# EAGLE design Accessory - Power v2 (EAGLE 5.06)
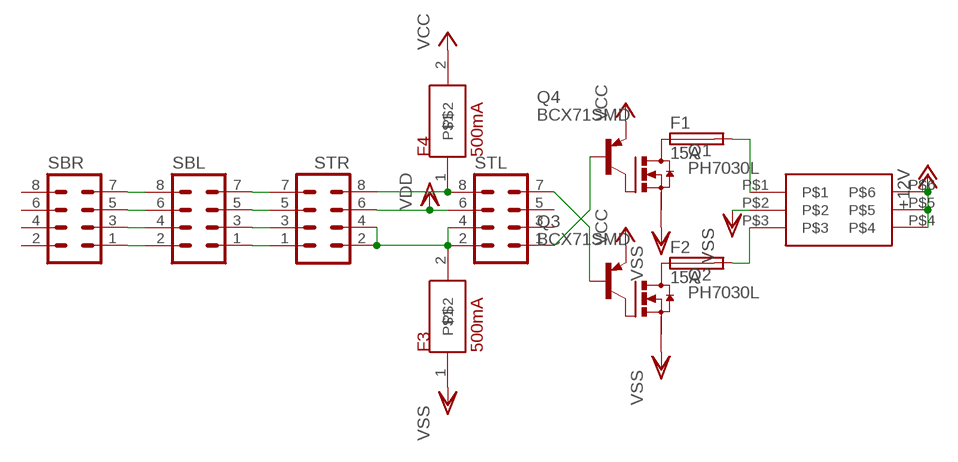
[diagram p0: schematic, sheet 1]

## Parts
F1  15A  FUSEPICOFUSE  [PICOFUSE]
F2  15A  FUSEPICOFUSE  [PICOFUSE]
F3  500mA  FUSE  [R0603]
F4  500mA  FUSE  [R0603]
Q1  PH7030L  [SOT669]
Q2  PH7030L  [SOT669]
Q3  BCX71SMD  [SOT23]
Q4  BCX71SMD  [SOT23]
SBL  MA04-2  [MA04-2]
SBR  MA04-2  [MA04-2]
STL  MA04-2  [MA04-2]
STR  MA04-2  [MA04-2]
U$1  015246040  [015246040]

## Nets
+12V: U$1.P$4 U$1.P$5 U$1.P$6
N$2: Q1.4(G) Q4.3(C)
N$3: Q2.4(G) Q3.3(C)
N$4: Q4.1(B) STL.1
N$5: Q3.1(B) STL.7
N$6: F2.1 Q2.MB(D)
N$7: F1.1 Q1.MB(D)
N$8: SBL.7 STR.7
N$9: SBL.5 STR.5
N$10: SBL.3 STR.3
N$11: SBL.1 STR.1
N$12: SBL.2 SBR.1
N$13: SBL.4 SBR.3
N$14: SBL.6 SBR.5
N$15: SBL.8 SBR.7
N$20: F4.1 STL.8 STR.8
N$21: F3.2 STL.2 STL.4 STR.2 STR.4
N$22: F2.2 U$1.P$3
N$23: F1.2 U$1.P$1
VCC: F4.2 Q3.2(E) Q4.2(E)
VDD: STL.6 STR.6
VSS: F3.1 Q1.1(S) Q2.1(S) U$1.P$2
Unconnected: Q1.2(S) Q1.3(S) Q2.2(S) Q2.3(S) SBR.2 SBR.4 SBR.6 SBR.8 STL.3 STL.5

## Library data of the parts
F1 F2 = fuse:FUSE: Fuse
F3 F4 = rcl:FUSE
Q1 Q2 = transistor-power:PH7030L: N-channel TrenchMOS (TM) logic level FET Source: http://www.nxp.com/acrobat_download/datasheets/PH7030L_4.pdf
Q3 Q4 = transistor-pnp:BCX71SMD: PNP Transistor
SBL SBR STL STR = con-lstb:MA04-2: PIN HEADER
U$1 = Power Headers:015246040

## Board
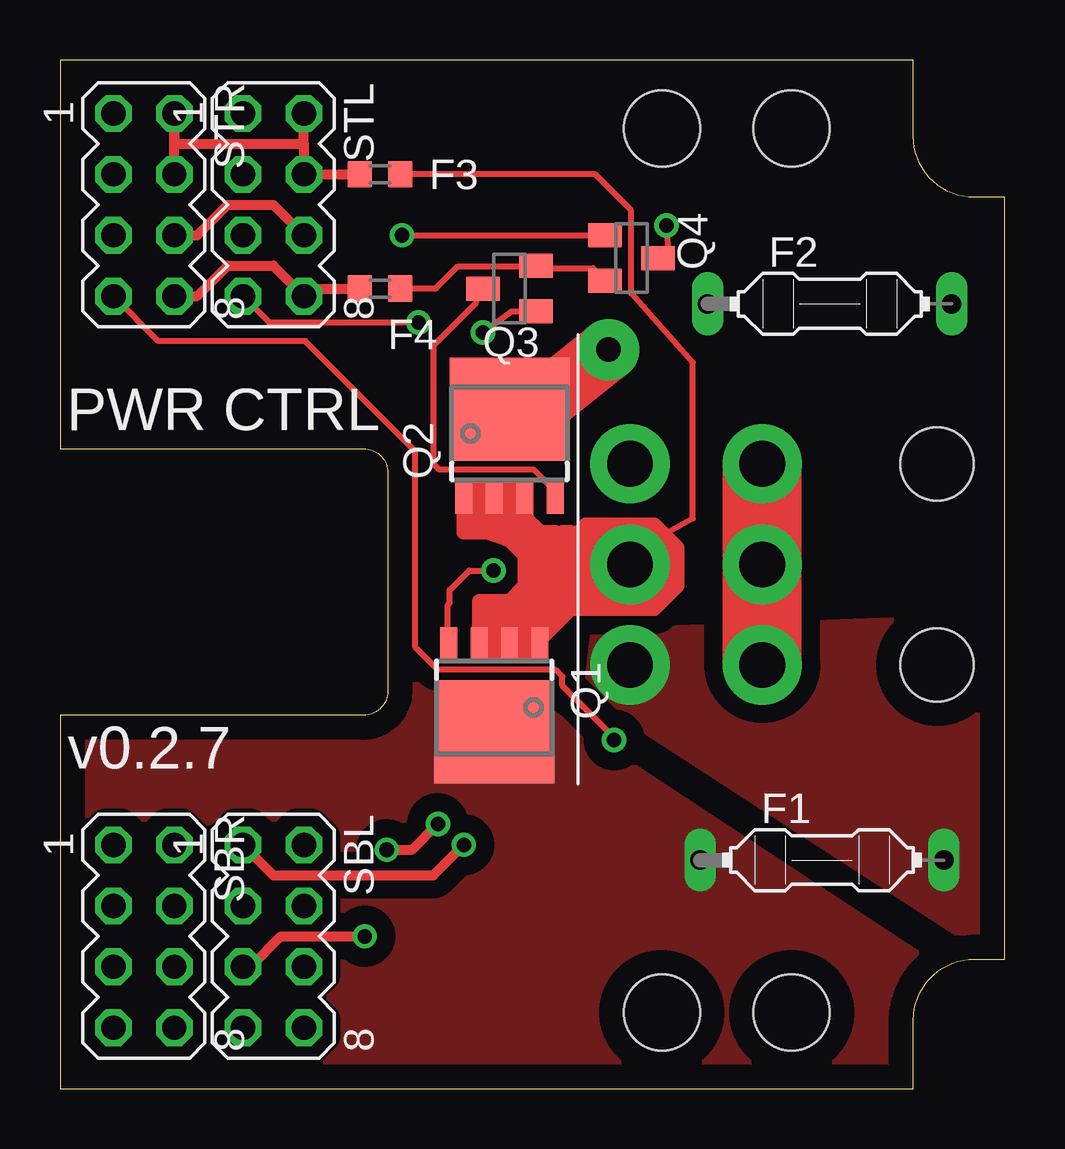
[diagram p1: board, top side]
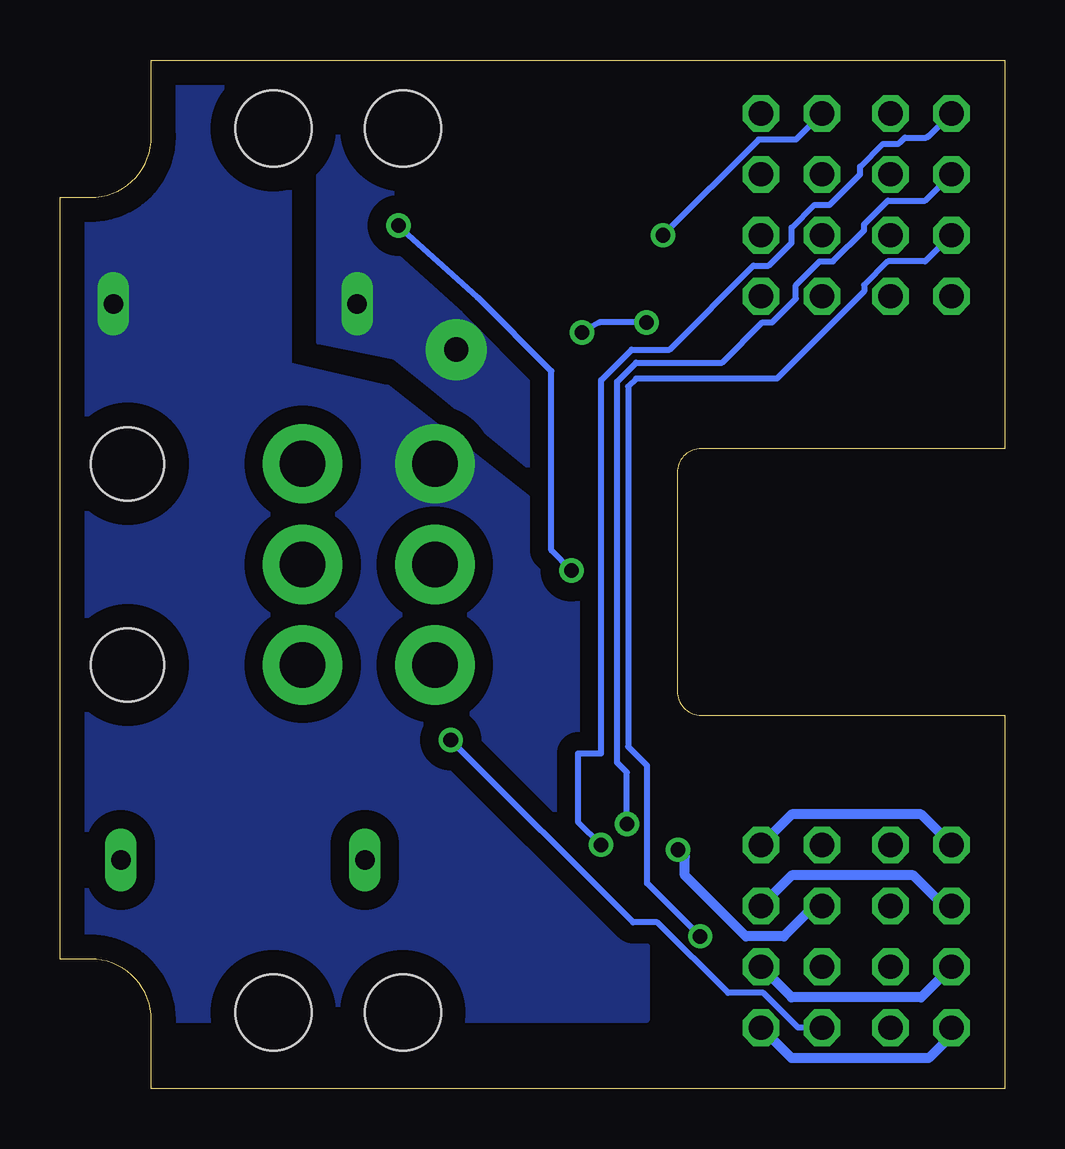
[diagram p2: board, bottom side, seen from below]

Size 39.37 x 42.86 mm. Coordinates in mm from the lower left corner, seen from the top.
Outline: 0,15.56 0,0 35.56,0 35.56,2.86 arc-90 38.1,5.4 39.37,5.4 39.37,37.15 38.11,37.14 arc-91 35.56,39.68 35.56,42.86 0,42.86 0,26.67 12.65,26.67 arc-90 13.65,25.67 13.65,16.56 arc-90 12.65,15.56 0,15.56
Copper layers (1*16): Top 0.035mm / dielectric 1.5mm / Bottom 0.035mm
Design rules "default *": minimum track width 10mil, minimum drill 24mil, track to track 30mil, track to pad 30mil, pad to pad 30mil, via to via 30mil, smd to smd 8mil, copper to edge 40mil, drill to drill 8mil, minimum pad ring 10mil, minimum via ring 8mil, stop-mask expansion 4mil, vias tented up to drill 0mil, thermal gap 0mil
Holes 3.17 mm at 30.48,40.01 30.48,3.17 25.08,40.01 25.08,3.17

### Footprints (pad centres in the part's own frame; a part is rotated, then mirrored left to right if it is on the bottom)
PICOFUSE = drill 0.813 long: 1 -5.08,0; 2 5.08,0
R0603 = smd 1 x 1.1: 1 -0.85,0; 2 0.85,0
SOT669 = smd 0.7 x 1.4: 1 -1.905,-2.65; 2 -0.635,-2.65; 3 0.635,-2.65; 4 1.905,-2.65 | smd 5 x 4.3: MB 0,1
SOT23 = smd 1 x 1.4: 1 -0.95,-1.1; 2 0.95,-1.1; 3 0,1.1
MA04-2 = drill 1.016 octagon: 1 -3.81,-1.27; 2 -3.81,1.27; 3 -1.27,-1.27; 4 -1.27,1.27; 5 1.27,-1.27; 6 1.27,1.27; 7 3.81,-1.27; 8 3.81,1.27
015246040 = drill 1.905 pad 3.302 round: P$1 -8.382,4.191; P$2 -4.191,4.191; P$3 0,4.191; P$4 0,-1.321; P$5 -4.191,-1.321; P$6 -8.382,-1.321 | hole 3.048: -8.382,-8.611; 0,-8.611

### Placement (x,y rotation side)
F1  31.75,9.53 0 top
F2  32.07,32.7 0 top
F3  13.34,38.1 180 top
F4  13.34,33.34 0 top
Q1  18.1,15.88 180 top
Q2  18.73,27.3 0 top
Q3  18.73,33.34 90 top
Q4  23.81,34.61 270 top
SBL  8.89,6.35 270 top
SBR  3.49,6.35 270 top
STL  8.89,36.83 270 top
STR  3.49,36.83 270 top
U$1  27.94,26.04 90 top

### Tracks (layer width: path | path; a pad name or v marks a point on that pad's centre or on a via)
+12V
  Top 3.302: U$1.P$4 U$1.P$5 U$1.P$6
N$2  (via drill 0.61)
  Top 0.254: 24.38,34.54 Q4.3 25.02,34.62 25.35,34.62 v25.27,35.97 | Q1.4 16.15,19 16.15,20.14 16.23,20.24 16.23,20.78 17.04,21.59 v18.06,21.59
  Bottom 0.254: v25.27,35.97 21.97,32.97 18.9,29.9 18.9,22.43 v18.06,21.59
N$3
  Top 0.254: Q2.4 20.62,24.66 20.62,24.92 19.74,25.81 15.79,25.81 15.58,26.01 15.58,30.98 17.31,32.7 17.63,33.33 Q3.3
N$4  (via drill 0.61)
  Top 0.254: v14.25,35.56 Q4.1
  Bottom 0.254: v14.25,35.56 10.26,39.55 8.71,39.55 STL.1
N$5  (via drill 0.61)
  Top 0.254: v17.63,31.51 18.82,32.38 19.81,32.38 Q3.1 | v14.94,31.93 8.71,31.93 STL.7
  Bottom 0.254: v17.63,31.51 16.89,31.93 v14.94,31.93
N$6  (via drill 1.02 pad 2.54)
  Top 2.54: v22.86,30.8 19.68,28.26 Q2.MB
  pour Bottom (no thermals): 28.57,42.55 14.92,42.55 14.92,21.91 23.81,29.21 25.4,30.48 28.57,31.11
N$7
  pour Top (no thermals): 0.32,16.83 18.73,16.83 41.91,1.59 41.91,0 29.53,0.32 0.32,0.32
N$8  (via drill 0.61)
  Top 0.254: v23.09,14.53 23.09,14.63 20.93,16.79 20.93,17.17 20.65,17.45 15.75,17.45 14.81,18.39 14.81,26.57 10.22,31.15 4.1,31.15 2.23,33.02 STR.7
  Bottom 0.254: SBL.7 8.61,2.54 10.06,3.99 11.53,3.99 14.48,6.93 15.49,6.93 v23.09,14.53
N$9  (via drill 0.6)
  Top 0.406: SBL.5 7.94,5.08 9.21,6.35 v12.7,6.35
  Bottom 0.254: STR.5 2.23,35.56 3.33,34.47 4.88,34.47 5.87,33.48 5.87,33.22 9.5,29.59 15.37,29.59 15.7,29.26 15.7,14.25 14.91,13.46 14.91,8.56 v12.7,6.35
N$10  (via drill 0.61)
  Top 0.406: v13.61,9.96 14.67,9.96 v15.75,11.04
  Bottom 0.254: v15.75,11.04 15.75,13.18 16.15,13.59 16.15,29.46 15.37,30.25 11.79,30.25 10.11,31.93 9.7,31.93 8.71,32.92 8.71,33.48 7.72,34.47 7.16,34.47 5.87,35.76 5.87,36.02 4.88,37.01 3.33,37.01 2.23,38.1 STR.3
  Bottom 0.406: SBL.3 7.94,7.62 9.21,6.35 10.79,6.35 13.34,8.89 13.34,9.68 v13.61,9.96
N$11  (via drill 0.6)
  Top 0.406: SBL.1 8.89,8.89 15.56,8.89 v16.83,10.16
  Bottom 0.254: STR.1 3.17,39.69 3.28,39.62 4.17,39.62 4.34,39.45 4.45,39.37 5.08,39.37 6.03,38.42 6.03,38.1 7.3,36.83 7.94,36.83 8.89,35.88 8.89,35.24 9.84,34.29 10.48,34.29 13.97,30.8 15.56,30.8 16.83,29.53 16.83,13.97 17.78,13.97 17.78,11.11 v16.83,10.16
N$12
  Bottom 0.406: SBR.1 3.49,11.43 8.89,11.43 SBL.2
N$13
  Bottom 0.406: SBR.3 2.54,7.62 3.81,8.89 8.89,8.89 SBL.4
N$14
  Bottom 0.406: SBR.5 3.49,3.81 8.89,3.81 SBL.6
N$15
  Bottom 0.406: SBR.7 2.22,2.22 3.17,1.27 8.89,1.27 SBL.8
N$20
  Top 0.254: F4.1 12.47,33.33
  Top 0.406: STR.8 5.71,33.02 6.99,34.29 8.89,34.29 STL.8 10.16,33.34 F4.1
N$21
  Top 0.406: STR.4 STR.2 4.76,39.37 10.16,39.37 | 10.16,39.37 STL.4 F3.2 | 10.16,39.37 STL.2
N$22
  pour Bottom (no thermals): 14.92,20.95 14.92,2.86 39.37,2.86 39.37,42.55 29.84,42.55 29.84,30.16 25.72,29.21 15.24,20.95
N$23
  pour Top (no thermals): 39.05,5.4 39.37,19.68 22.23,19.05 21.91,16.51
N$25
  Top 0.61: 20.64,20 20.95,20.32
N$26
  Top 0.61: 23.81,21.59 22.23,21.59 22.54,21.27 23.81,21.27 24.13,21.59 24.13,21.91 22.23,21.91 21.91,21.59 | 21.91,21.59 21.91,21.91 22.23,22.23 24.13,22.23 24.77,21.59 24.45,21.59 23.81,20.95 22.54,20.95 21.91,21.59 | 21.91,21.59 21.91,20.95 22.23,20.64 24.13,20.64 25.08,21.59 25.08,21.91 24.45,22.54 21.91,22.54 | 21.91,22.86 21.59,22.86 21.59,23.18 22.86,23.18 22.86,22.86 | 21.91,22.86 24.77,22.86 25.4,22.23 25.4,21.27 24.45,20.32 21.91,20.32 21.59,20.64 21.59,21.27 | 20,23.18 20.32,22.86 | 20,23.18 19.68,23.18 | 19.37,19.37 19.37,19.05 | 19.37,19.37 18.41,19.37 | 19.37,19.37 19.37,19.68 18.1,19.68 18.1,18.73 19.68,18.73 19.68,20 17.78,20 17.78,18.41 20,18.41 20,18.73 | 20,23.18 20.64,23.18 20.64,22.86 20.95,22.54 20.95,23.18 21.27,23.18 | 22.86,22.86 21.91,22.86 | 22.86,22.86 22.86,22.54 21.91,22.54 | 22.86,22.86 23.18,22.86 23.18,23.5 | 23.18,23.5 21.91,23.5 | 20.64,20.95 20.32,20.64 arc-135 20.13,21.09 20.64,21.59 | 20.64,20.95 20.95,21.27 | 16.83,24.77 16.83,23.5 19.05,23.5 | 21.91,22.54 21.59,22.23 21.59,21.27 | 21.91,22.54 21.27,22.54 21.27,23.18 | 20.64,21.91 19.68,22.86 | 19.68,22.86 19.05,23.5 | 23.18,23.5 24.77,23.5 25.72,22.54 25.72,20.95 24.77,20 21.27,20 | 19.37,23.5 19.05,23.5 | 21.59,20.32 20.95,19.68 20.32,19.68 20,19.37 20,18.73 | 20.95,20.64 20.32,20 | 20.95,20.64 20,20.64 | 20.95,20.64 21.59,21.27 | 21.27,21.59 21.27,23.18 | 20.64,22.23 21.27,21.59 | 20.64,22.23 19.68,23.18 | 19.68,23.18 19.37,23.5 | 20.64,21.59 21.27,21.59 | 21.27,21.59 21.27,20.64 | 21.27,20.64 20.95,20.64 | 21.27,20 21.27,20.64 | 20,18.73 21.27,20 | 20,18.73 20,20.32 19.05,20.32 | 18.73,20.32 19.05,20.32 | 18.73,20.32 arc193 19.05,23.18
  Top 0.61: 18.73,20.32 17.46,20.32 17.46,18.1 20,18.1 | 19.37,23.5 19.37,23.81 | 19.37,24.13 19.37,25.08 19.05,25.08 | 19.37,24.13 19.37,23.81 | 19.05,25.08 16.83,25.08 16.83,23.18 17.78,23.18 | 18.1,23.18 17.78,23.18 | 19.05,23.18 18.41,23.18 | 18.41,23.18 18.1,23.18 | 19.05,23.18 19.05,23.81 | 19.05,23.81 19.05,25.08 | 19.05,25.08 17.14,25.08 17.14,24.77 17.46,24.77 17.46,23.81 19.05,23.81 | 19.05,23.81 18.41,23.81 18.41,24.77 18.73,24.77 18.73,24.13 18.1,24.13 18.1,24.77 | 19.37,23.81 20,23.18 | 20.64,21.59 20.64,20.95 | 19.68,22.54 20.64,21.59 | 19.05,23.18 19.68,22.54 | 20.64,21.91 20.64,22.23 | 19.05,20.32 20,21.27 | 20,21.27 20.64,21.91 | 18.1,23.18 19.68,22.54 | 19.68,22.86 19.68,20.64 19.37,20.64 19.37,20.95 | 19.37,20.95 19.37,22.23 18.73,22.86 | 18.41,23.18 18.73,22.86 | 18.73,20.32 19.37,20.95 | 18.73,22.86 17.78,23.18 | 20,21.27 20,21.91 | 19.37,24.13 19.68,23.18
N$28
  Top 0.61: 17.14,24.45 17.14,23.81
VCC
  Top 0.254: Q4.2 22.71,33.68 22.2,34.19 19.89,34.19 Q3.2 19.71,34.27 16.57,34.27 15.66,33.35 F4.2
VDD
  Top 0.406: STR.6 5.71,35.56 6.99,36.83 8.89,36.83 STL.6
VSS
  Top 0.254: F3.1 22.3,38.1 23.8,36.6 23.8,33.13 26.36,30.25 26.36,23.76 24.21,22.55 U$1.P$2 | Q2.1 19.37,24.66 19.37,23.18 23.75,23.18 U$1.P$2 | Q1.1 20,19.37 22.54,21.91 23.69,21.91 U$1.P$2
  pour Top (no thermals): 22.54,20.32 24.77,20 25.72,20.95 25.72,22.54

### Text on the board
tNames: PWR CTRL | v0.2.7